# EAGLE schematic LR1302_LoRaWAN_Gateway_Module_V1.0_868SPI (EAGLE 9.5.1)
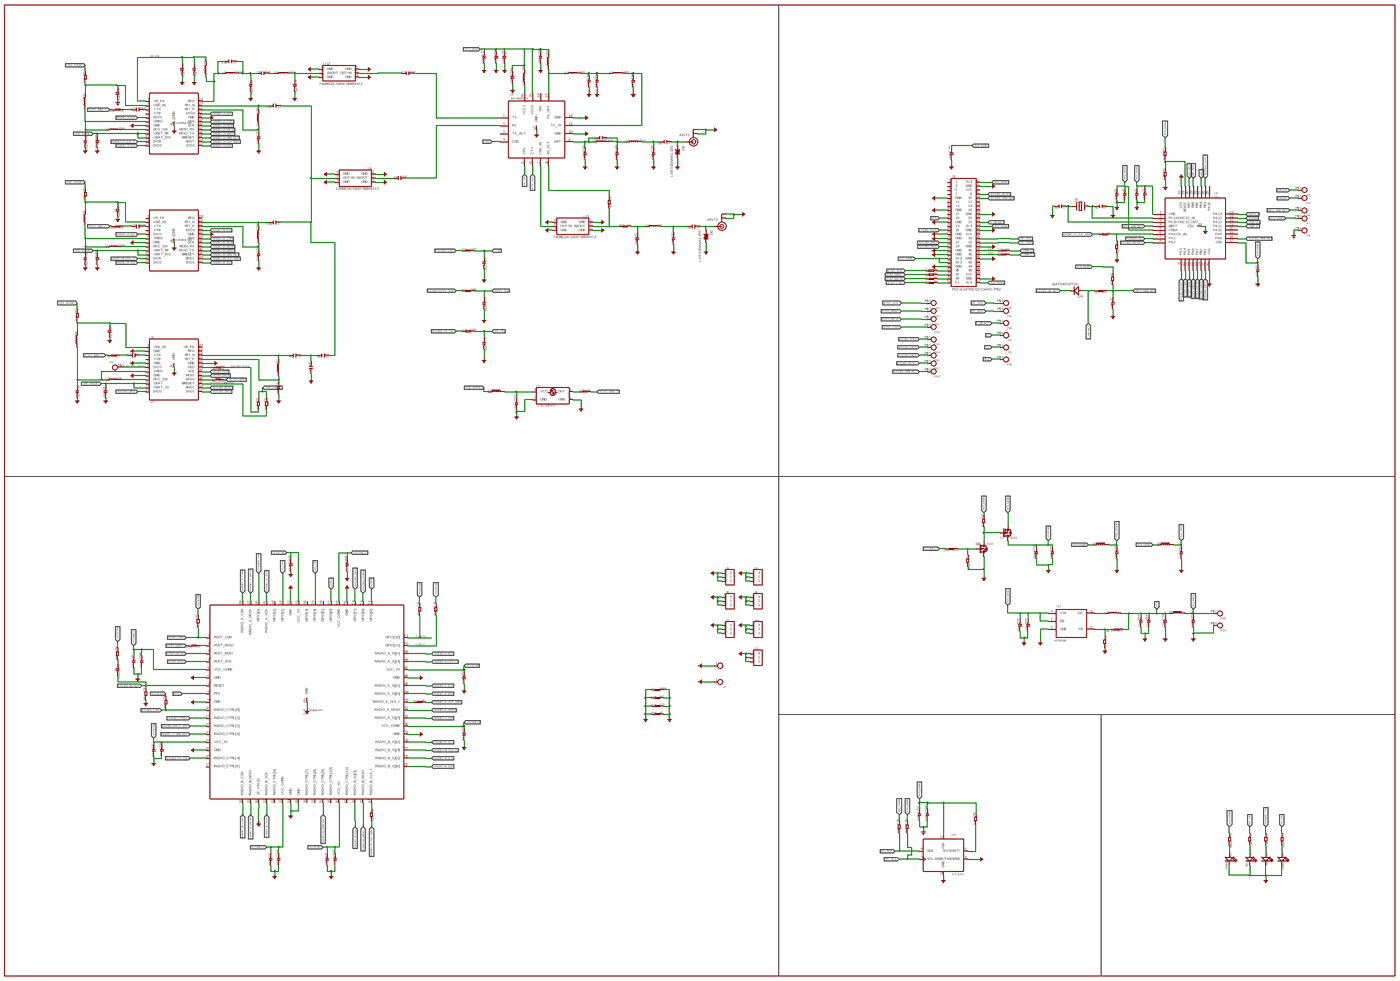
[diagram p0: schematic, sheet 1, overview]
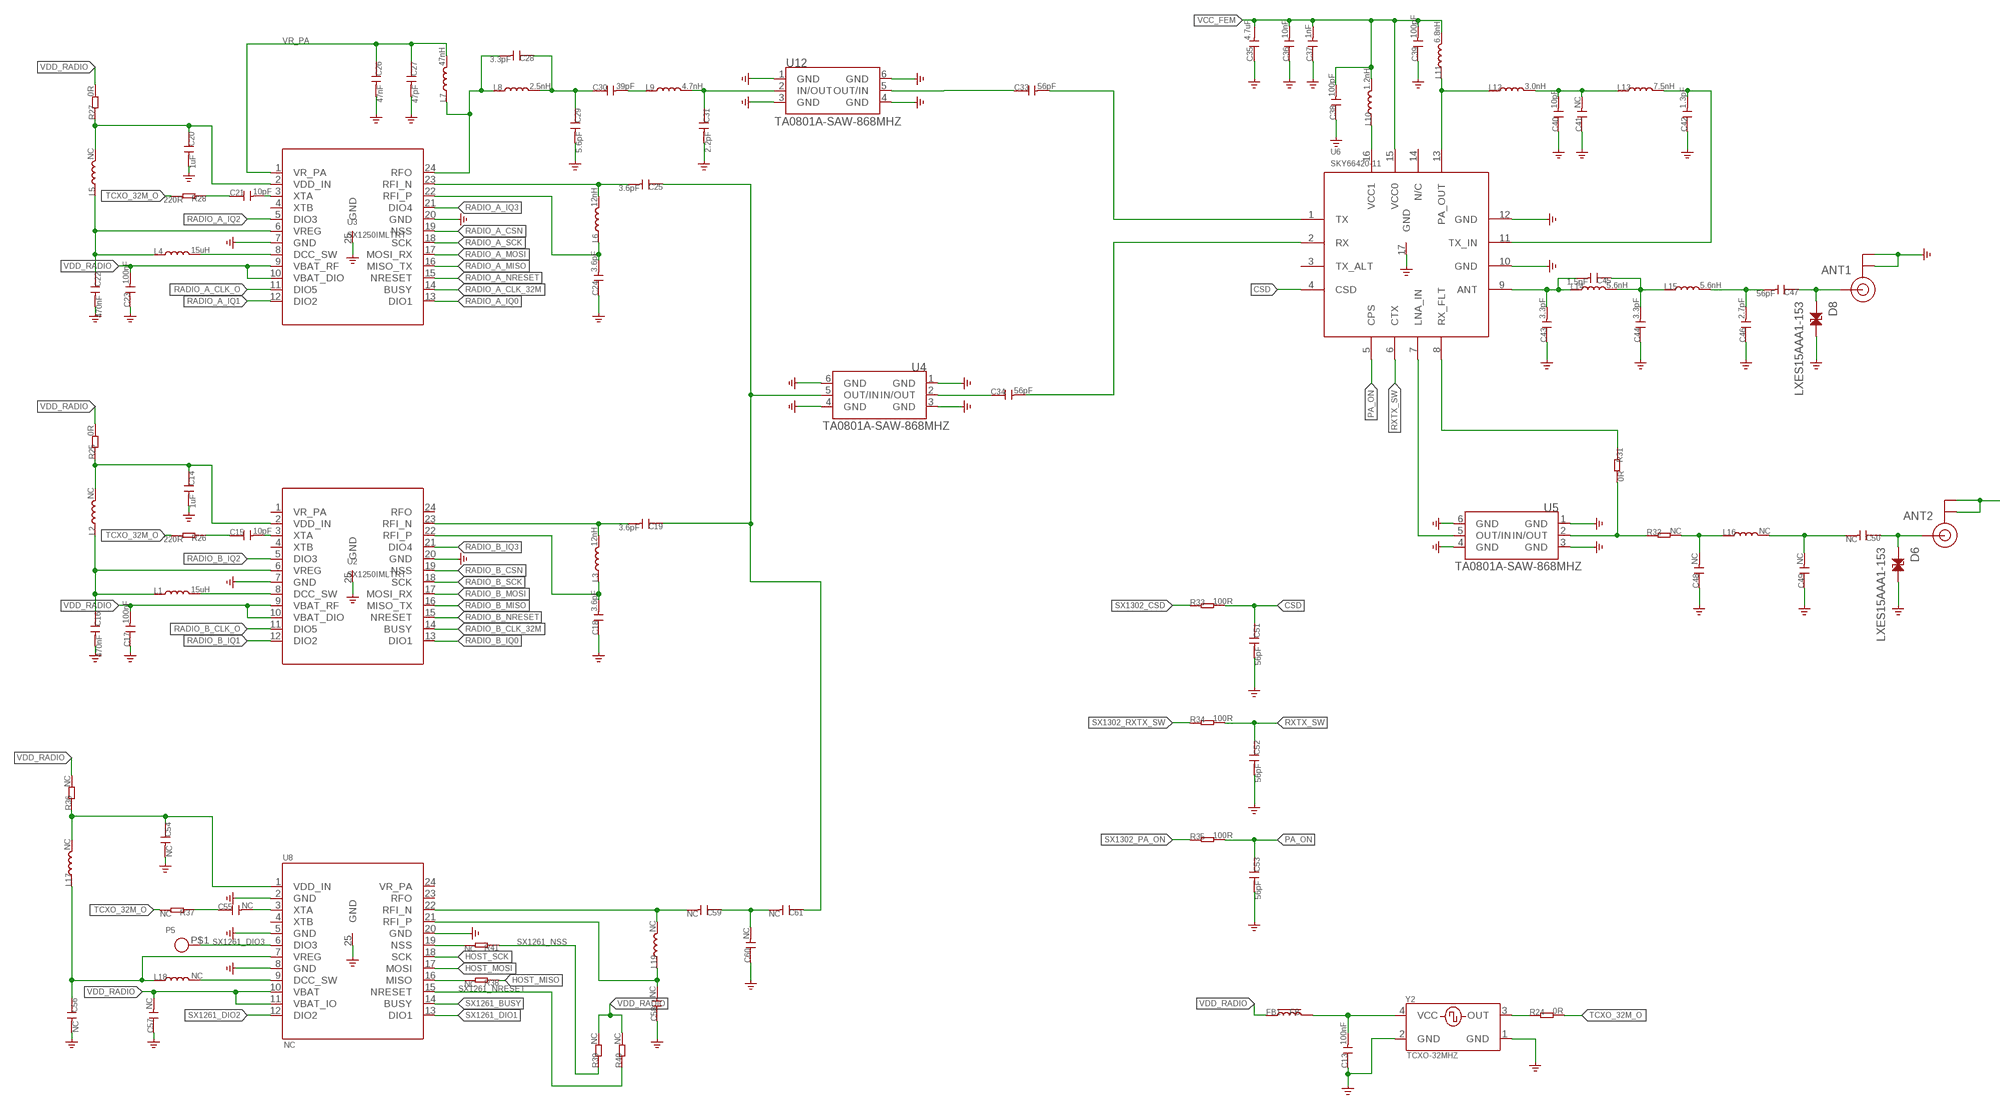
[diagram p1: schematic, sheet 1, part 1 of 4]
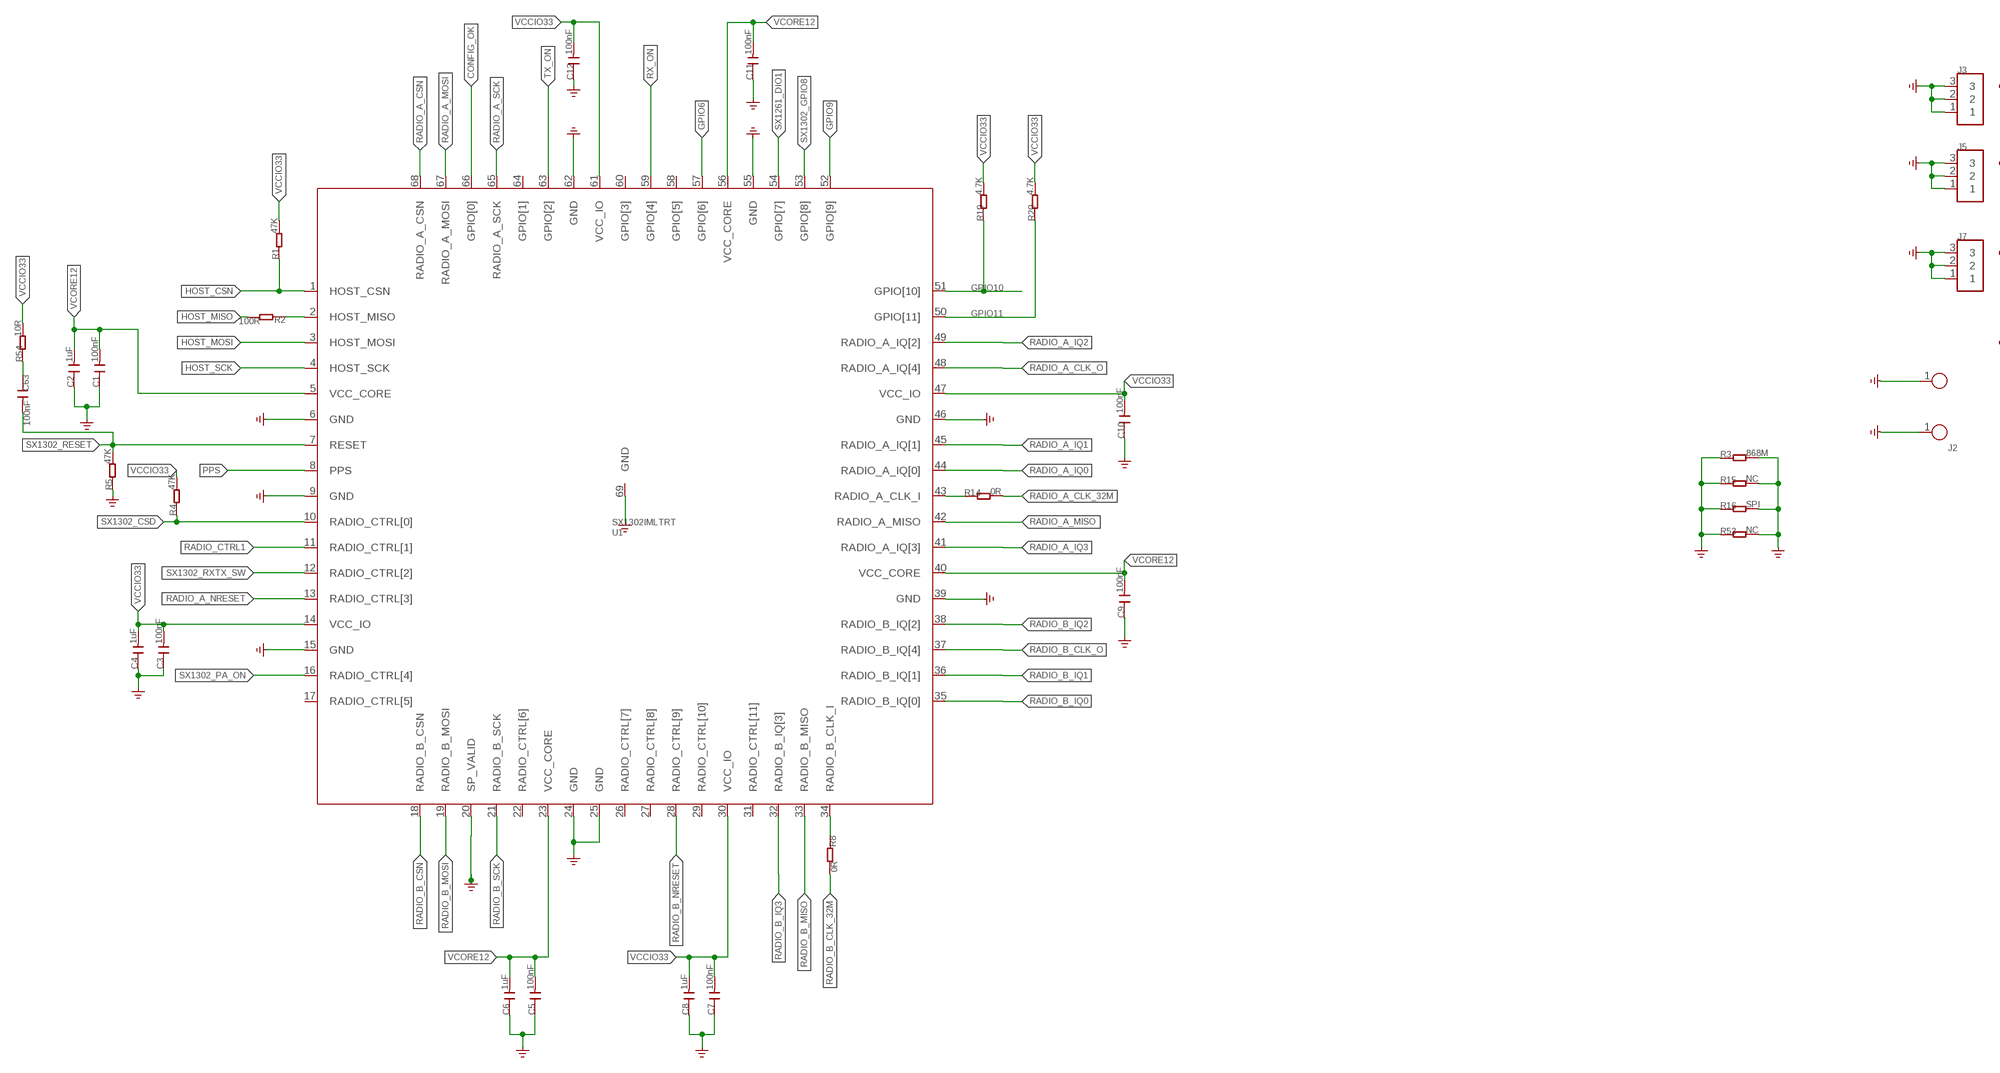
[diagram p2: schematic, sheet 1, part 2 of 4]
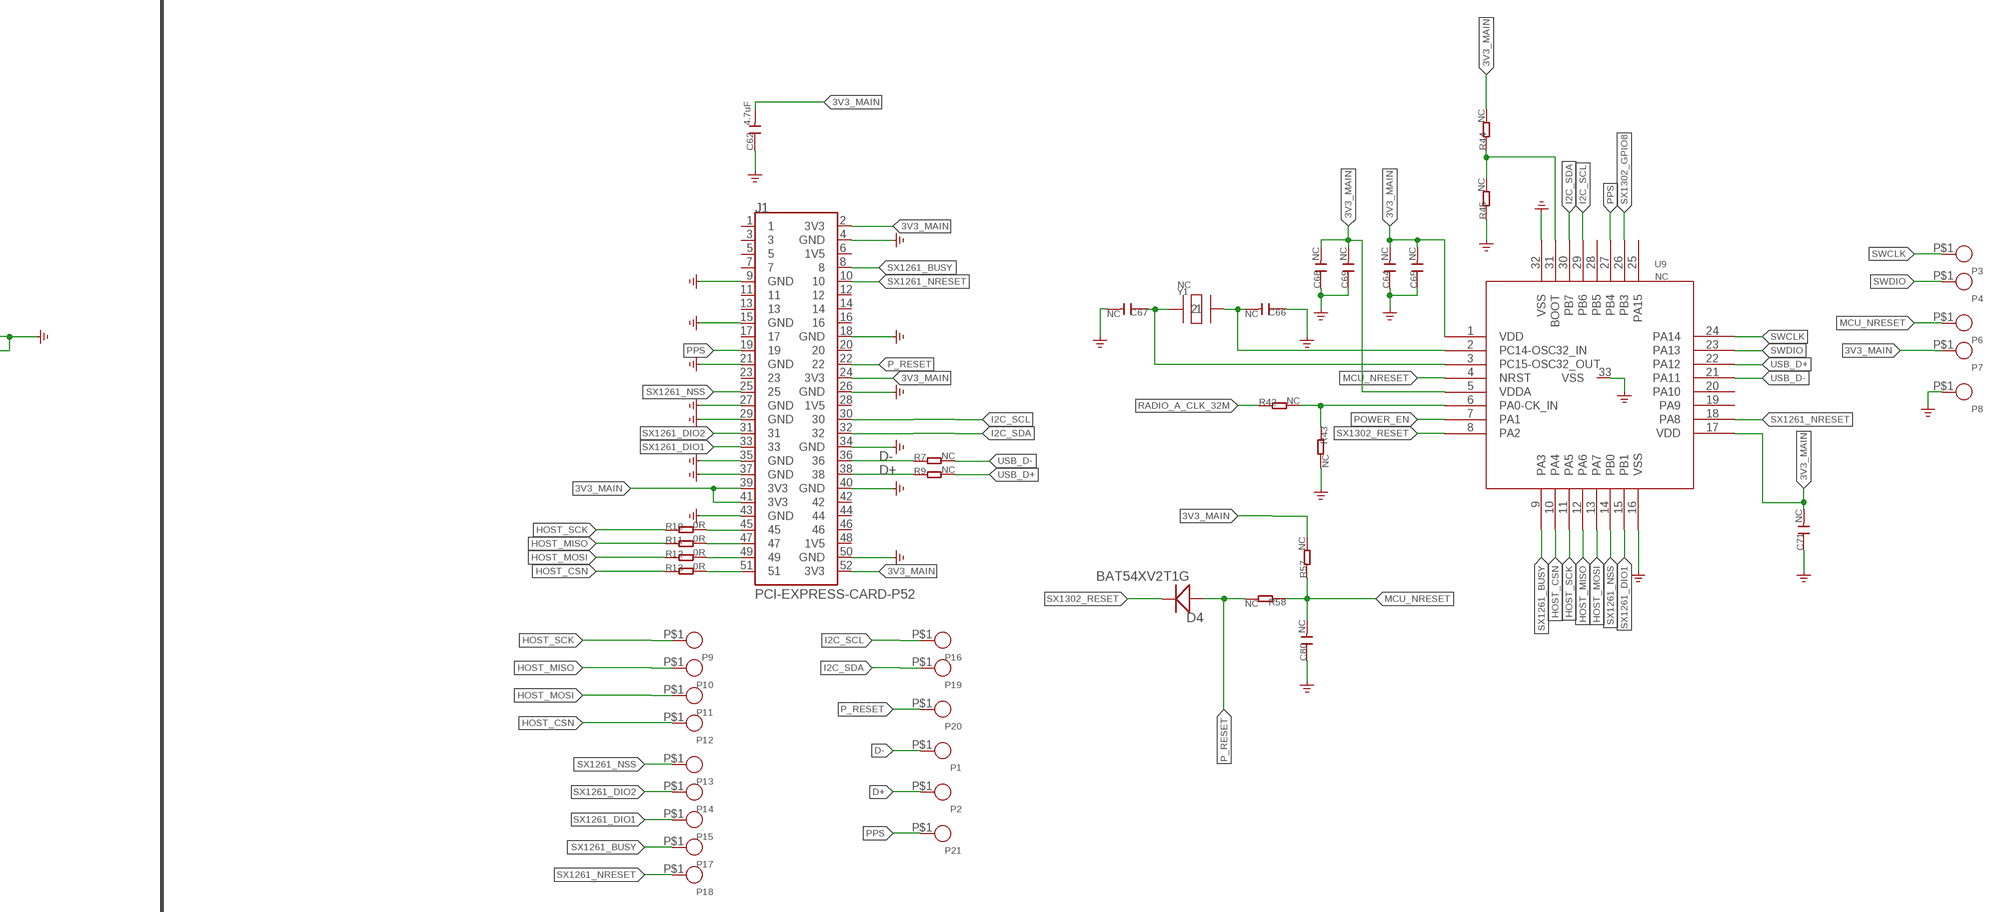
[diagram p3: schematic, sheet 1, part 3 of 4]
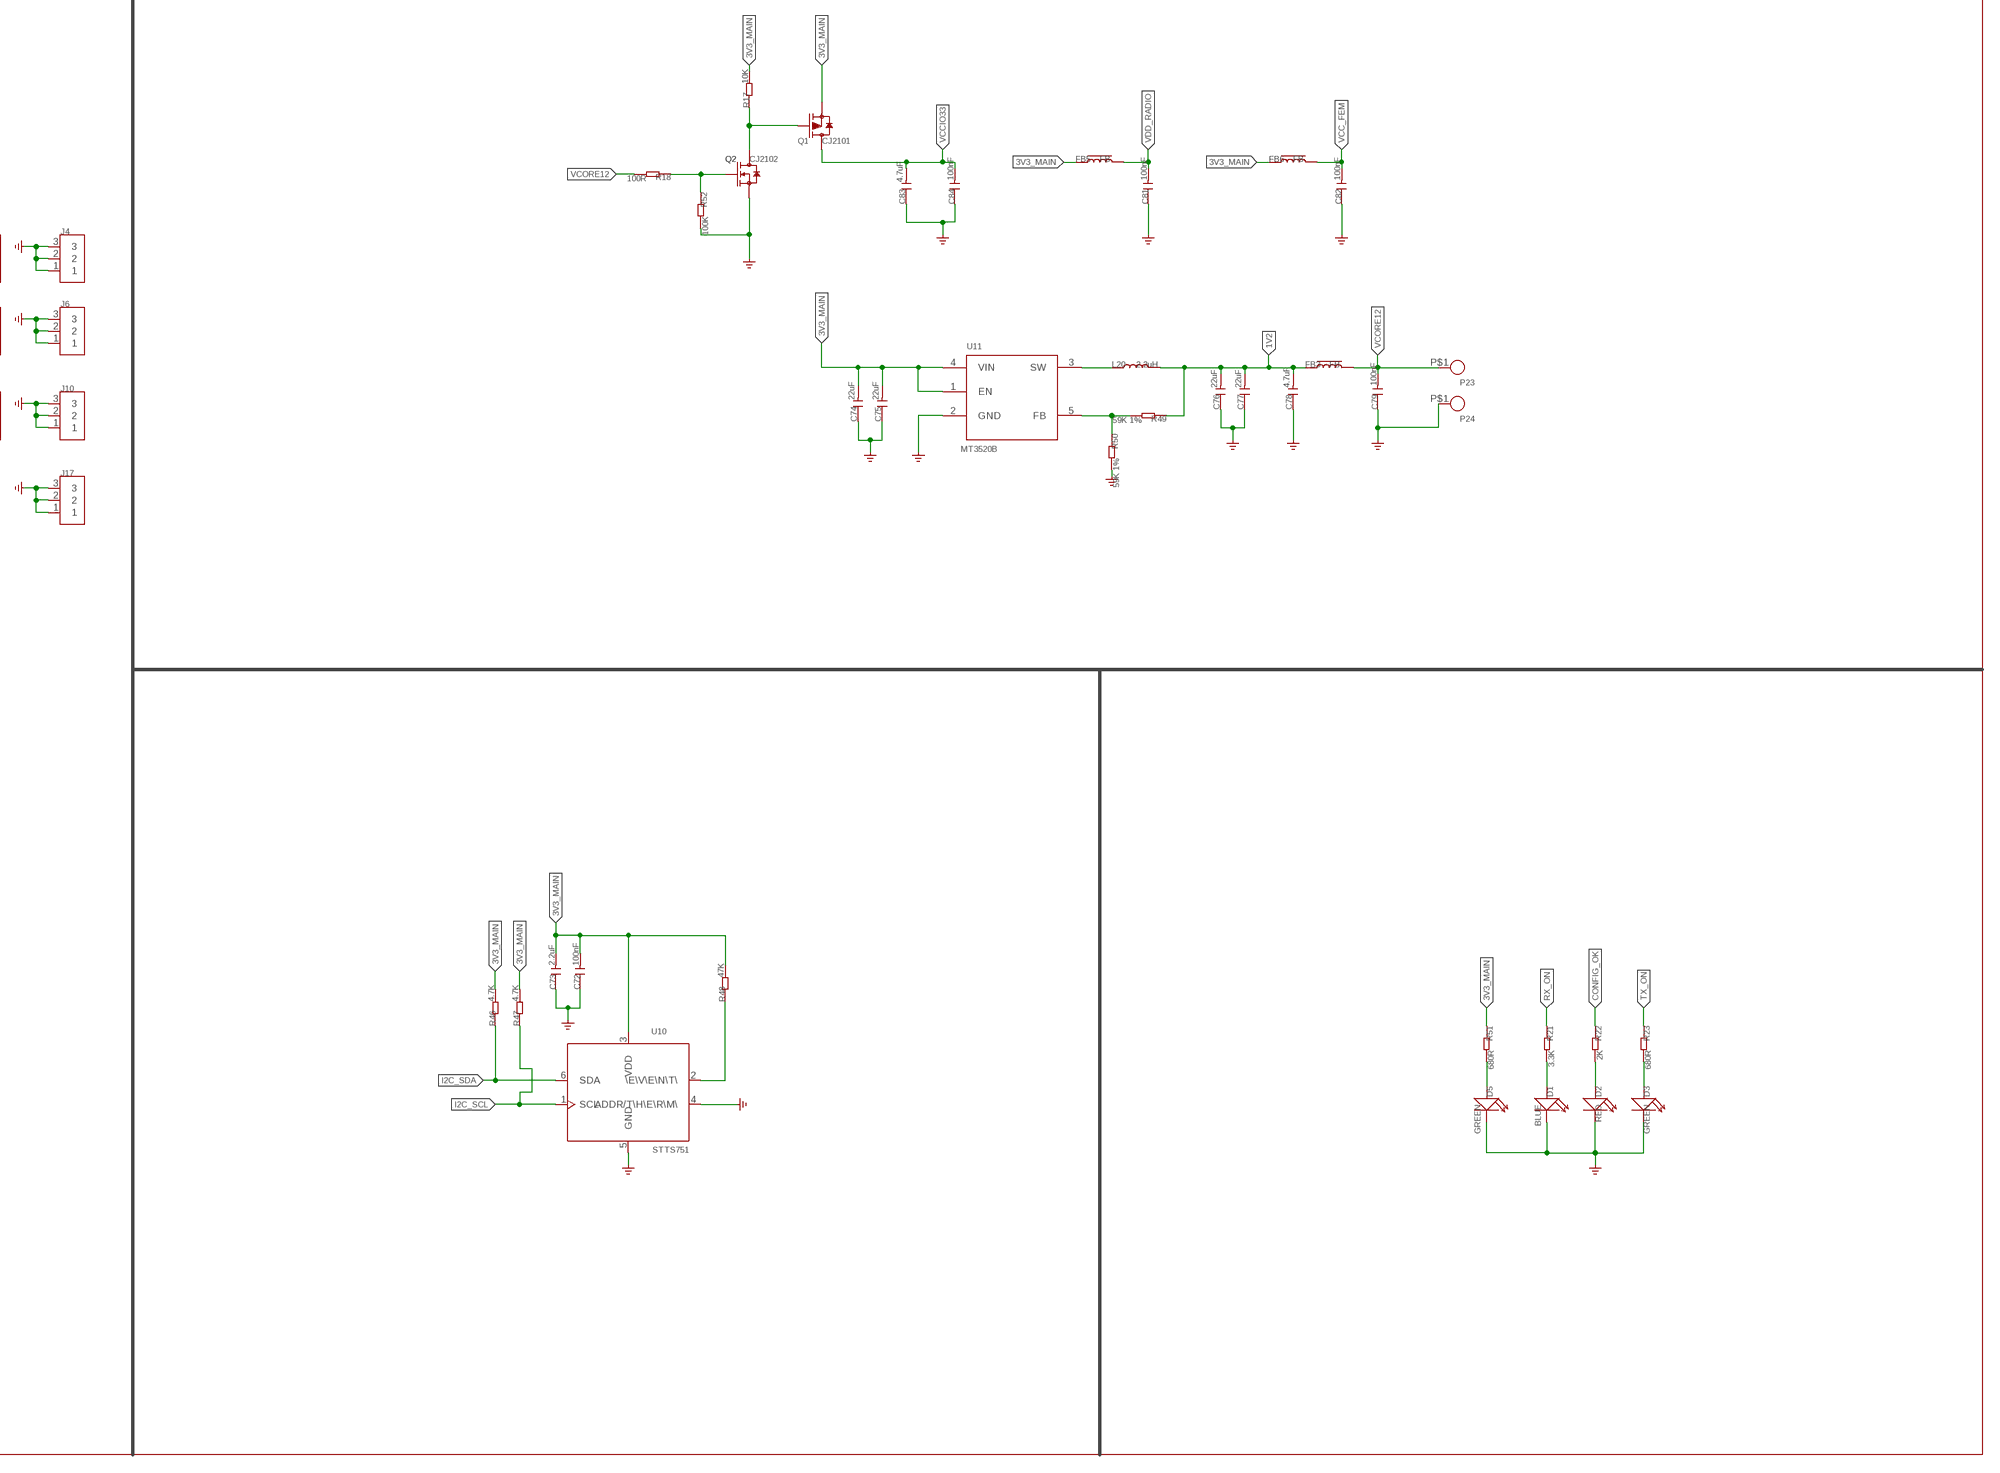
[diagram p4: schematic, sheet 1, part 4 of 4]

## Parts
ANT1  U.FL_SMTU.FL-R-SMD  [U.FL-R-SMD]
ANT2  NC  U.FL_SMTU.FL-R-SMD  [U.FL-R-SMD]
C1  100nF  CAPC0402-1  [C0402]
C2  1uF  CAPC0402-1  [C0402]
C3  100nF  CAPC0402-1  [C0402]
C4  1uF  CAPC0402-1  [C0402]
C5  100nF  CAPC0402-1  [C0402]
C6  1uF  CAPC0402-1  [C0402]
C7  100nF  CAPC0402-1  [C0402]
C8  1uF  CAPC0402-1  [C0402]
C9  100nF  CAPC0402-1  [C0402]
C10  100nF  CAPC0402-1  [C0402]
C11  100nF  CAPC0402-1  [C0402]
C12  100nF  CAPC0402-1  [C0402]
C13  100nF  CAPC0402-1  [C0402]
C14  1uF  CAPC0402-1  [C0402]
C15  10pF  CAPC0402-1  [C0402]
C16  470nF  CAPC0402-1  [C0402]
C17  100nF  CAPC0402-1  [C0402]
C18  3.6pF  CAPC0402-1  [C0402]
C19  3.6pF  CAPC0402-1  [C0402]
C20  1uF  CAPC0402-1  [C0402]
C21  10pF  CAPC0402-1  [C0402]
C22  470nF  CAPC0402-1  [C0402]
C23  100nF  CAPC0402-1  [C0402]
C24  3.6pF  CAPC0402-1  [C0402]
C25  3.6pF  CAPC0402-1  [C0402]
C26  47nF  CAPC0402-1  [C0402]
C27  47pF  CAPC0402-1  [C0402]
C28  3.3pF  CAPC0402-1  [C0402]
C29  5.6pF  CAPC0402-1  [C0402]
C30  39pF  CAPC0402-1  [C0402]
C31  2.2pF  CAPC0402-1  [C0402]
C33  56pF  CAPC0402-1  [C0402]
C34  56pF  CAPC0402-1  [C0402]
C35  4.7uF  CAP  [C0603]
C36  10nF  CAPC0402-1  [C0402]
C37  1nF  CAPC0402-1  [C0402]
C38  100pF  CAPC0402-1  [C0402]
C39  100pF  CAPC0402-1  [C0402]
C40  10pF  CAPC0402-1  [C0402]
C41  NC  CAPC0402-1  [C0402]
C42  1.3pF  CAPC0402-1  [C0402]
C43  3.3pF  CAPC0402-1  [C0402]
C44  3.3pF  CAPC0402-1  [C0402]
C45  1.5pF  CAPC0402-1  [C0402]
C46  2.7pF  CAPC0402-1  [C0402]
C47  56pF  CAPC0402-1  [C0402]
C48  NC  CAPC0402-1  [C0402]
C49  NC  CAPC0402-1  [C0402]
C50  NC  CAPC0402-1  [C0402]
C51  56pF  CAPC0402-1  [C0402]
C52  56pF  CAPC0402-1  [C0402]
C53  56pF  CAPC0402-1  [C0402]
C54  NC  CAPC0402-1  [C0402]
C55  NC  CAPC0402-1  [C0402]
C56  NC  CAPC0402-1  [C0402]
C57  NC  CAPC0402-1  [C0402]
C58  NC  CAPC0402-1  [C0402]
C59  NC  CAPC0402-1  [C0402]
C60  NC  CAPC0402-1  [C0402]
C61  NC  CAPC0402-1  [C0402]
C62  4.7uF  CAP  [C0603]
C63  100nF  CAPC0402-1  [C0402]
C64  NC  CAPC0402-1  [C0402]
C65  NC  CAPC0402-1  [C0402]
C66  NC  CAPC0402-1  [C0402]
C67  NC  CAPC0402-1  [C0402]
C68  NC  CAPC0402-1  [C0402]
C69  NC  CAPC0402-1  [C0402]
C71  NC  CAPC0402-1  [C0402]
C72  100nF  CAPC0402-1  [C0402]
C73  2.2uF  CAPC0402-1  [C0402]
C74  22uF  CAP  [C0603]
C75  22uF  CAP  [C0603]
C76  22uF  CAP  [C0603]
C77  22uF  CAP  [C0603]
C78  4.7uF  CAP  [C0603]
C79  100nF  CAPC0402-1  [C0402]
C80  NC  CAPC0402-1  [C0402]
C81  100nF  CAPC0402-1  [C0402]
C82  100nF  CAPC0402-1  [C0402]
C83  4.7uF  CAP  [C0603]
C84  100nF  CAPC0402-1  [C0402]
D1  BLUE  LED-SMT  [LED-0402]
D2  RED  LED-SMT  [LED-0402]
D3  GREEN  LED-SMT  [LED-0402]
D4  BAT54XV2T1G  DIODE0603  [D_SOD523]
D5  GREEN  LED-SMT  [LED-0402]
D6  LXES15AAA1-153  PESD0402  [D0402]
D8  LXES15AAA1-153  PESD0402  [D0402]
FB1  FB  [L0402]
FB3  FB  [L0402]
FB5  FB  [L0402]
FB6  FB  [L0402]
J1  PCI-EXPRESS-CARD-P52  [PCIE-MINI-S52]
J2  PAD-THO-2.65MM  [PAD-THO-2.6*5MM]
J3  PBJ-ICSRC6508-SMD  [PBJ-ICSRC6508-SMD]
J4  PBJ-ICSRC6508-SMD  [PBJ-ICSRC6508-SMD]
J5  PBJ-ICSRC6508-SMD  [PBJ-ICSRC6508-SMD]
J6  PBJ-ICSRC6508-SMD  [PBJ-ICSRC6508-SMD]
J7  PBJ-ICSRC6508-SMD  [PBJ-ICSRC6508-SMD]
J10  PBJ-ICSRC6508-SMD  [PBJ-ICSRC6508-SMD]
J11  PAD-THO-2.65MM  [PAD-THO-2.6*5MM]
J17  PBJ-ICSRC6508-SMD  [PBJ-ICSRC6508-SMD]
L1  15uH  L0805  [L0805]
L2  NC  L0402  [L0402]
L3  12nH  L0402  [L0402]
L4  15uH  L0805  [L0805]
L5  NC  L0402  [L0402]
L6  12nH  L0402  [L0402]
L7  47nH  L0402  [L0402]
L8  2.5nH  L0402  [L0402]
L9  4.7nH  L0402  [L0402]
L10  1.2nH  L0402  [L0402]
L11  6.8nH  L0402  [L0402]
L12  3.0nH  L0402  [L0402]
L13  7.5nH  L0402  [L0402]
L14  5.6nH  L0402  [L0402]
L15  5.6nH  L0402  [L0402]
L16  NC  L0402  [L0402]
L17  NC  L0402  [L0402]
L18  NC  L0805  [L0805]
L19  NC  L0402  [L0402]
L20  2.2uH  L  [L3015_SMD]
P1  TEST_PADPAD-1.0MM  [TEST_PAD-1.0MM]
P2  TEST_PADPAD-1.0MM  [TEST_PAD-1.0MM]
P3  TEST_PADPAD-1.0MM  [TEST_PAD-1.0MM]
P4  TEST_PADPAD-1.0MM  [TEST_PAD-1.0MM]
P5  TEST_PADPAD-1.0MM  [TEST_PAD-1.0MM]
P6  TEST_PADPAD-1.0MM  [TEST_PAD-1.0MM]
P7  TEST_PADPAD-1.0MM  [TEST_PAD-1.0MM]
P8  TEST_PADPAD-1.0MM  [TEST_PAD-1.0MM]
P9  TEST_PADPAD-1.0MM  [TEST_PAD-1.0MM]
P10  TEST_PADPAD-1.0MM  [TEST_PAD-1.0MM]
P11  TEST_PADPAD-1.0MM  [TEST_PAD-1.0MM]
P12  TEST_PADPAD-1.0MM  [TEST_PAD-1.0MM]
P13  TEST_PADPAD-1.0MM  [TEST_PAD-1.0MM]
P14  TEST_PADPAD-1.0MM  [TEST_PAD-1.0MM]
P15  TEST_PADPAD-1.0MM  [TEST_PAD-1.0MM]
P16  TEST_PADPAD-1.0MM  [TEST_PAD-1.0MM]
P17  TEST_PADPAD-1.0MM  [TEST_PAD-1.0MM]
P18  TEST_PADPAD-1.0MM  [TEST_PAD-1.0MM]
P19  TEST_PADPAD-1.0MM  [TEST_PAD-1.0MM]
P20  TEST_PADPAD-1.0MM  [TEST_PAD-1.0MM]
P21  TEST_PADPAD-1.0MM  [TEST_PAD-1.0MM]
P23  TEST_PADPAD-1.0MM  [TEST_PAD-1.0MM]
P24  TEST_PADPAD-1.0MM  [TEST_PAD-1.0MM]
Q1  CJ2101  MOSFET-P  [MOS_SOT323]
Q2  CJ2102  MOSFET-NSI1304BDL  [MOS_SOT323]
R1  47K  RES-0402  [R0402]
R2  100R  RES-0402  [R0402]
R3  868M  RES-0402  [R0402]
R4  47K  RES-0402  [R0402]
R5  47K  RES-0402  [R0402]
R7  NC  RES-0402  [R0402]
R8  0R  RES-0402  [R0402]
R9  NC  RES-0402  [R0402]
R10  0R  RES-0402  [R0402]
R11  0R  RES-0402  [R0402]
R12  0R  RES-0402  [R0402]
R13  0R  RES-0402  [R0402]
R14  0R  RES-0402  [R0402]
R15  NC  RES-0402  [R0402]
R16  SPI  RES-0402  [R0402]
R17  10K  RES-0402  [R0402]
R18  100R  RES-0402  [R0402]
R19  4.7K  RES-0402  [R0402]
R20  4.7K  RES-0402  [R0402]
R21  3.3K  RES-0402  [R0402]
R22  2K  RES-0402  [R0402]
R23  680R  RES-0402  [R0402]
R24  0R  RES-0402  [R0402]
R25  0R  RES-0402  [R0402]
R26  220R  RES-0402  [R0402]
R27  0R  RES-0402  [R0402]
R28  220R  RES-0402  [R0402]
R31  0R  RES-0402  [R0402]
R32  NC  RES-0402  [R0402]
R33  100R  RES-0402  [R0402]
R34  100R  RES-0402  [R0402]
R35  100R  RES-0402  [R0402]
R36  NC  RES-0402  [R0402]
R37  NC  RES-0402  [R0402]
R38  NC  RES-0402  [R0402]
R39  NC  RES-0402  [R0402]
R40  NC  RES-0402  [R0402]
R41  NC  RES-0402  [R0402]
R42  NC  RES-0402  [R0402]
R43  NC  RES-0402  [R0402]
R44  NC  RES-0402  [R0402]
R45  NC  RES-0402  [R0402]
R46  4.7K  RES-0402  [R0402]
R47  4.7K  RES-0402  [R0402]
R48  47K  RES-0402  [R0402]
R49  59K 1%  RES-0402  [R0402]
R50  59K 1%  RES-0402  [R0402]
R51  680R  RES-0402  [R0402]
R52  100K  RES-0402  [R0402]
R53  NC  RES-0402  [R0402]
R54  10R  RES-0402  [R0402]
R57  NC  RES-0402  [R0402]
R58  NC  RES-0402  [R0402]
U1  SX1302IMLTRT  [QFN68-7*7MM]
U2  SX1250IMLTRT  [QFN24-4*4MM]
U3  SX1250IMLTRT  [QFN24-4*4MM]
U4  TA0801A-SAW-868MHZ  [SAW-SMD6-3*3MM]
U5  TA0801A-SAW-868MHZ  [SAW-SMD6-3*3MM]
U6  SKY66420-11  [MCM-16-EP(3X3)]
U8  NC  SX1261IMLTRT  [QFN24-4*4MM]
U9  NC  STM32L412KX  [UFQFPN-32-5*5MM]
U10  STTS751  [UDFN-6(2X2)]
U11  MT3520B  [IC_SOT23-5]
U12  TA0801A-SAW-868MHZ  [SAW-SMD6-3*3MM]
Y1  NC  XTAL-32.768KHZ  [XATL-3215-SMD]
Y2  TCXO-32MHZ  [TXCO-SMD2.0*1.6]

## Nets
1V2: C76.2 C77.2 C78.2 FB3.1 L20.2 R49.1
3V3_MAIN: C62.2 C64.2 C65.2 C68.2 C69.2 C71.2 C72.2 C73.2 C74.2 C75.2 FB5.1 FB6.1 J1.2(3V3) J1.24(3V3) J1.39(3V3) J1.41(3V3) J1.52(3V3) P7.P$1 Q1.2(S) R17.2 R44.2 R46.2 R47.2 R48.2 R51.1 R57.2 U9.1(VDD) U9.5(VDDA) U9.17(VDD) U10.3(VDD) U11.1(EN) U11.4(VIN)
CONFIG_OK: R22.1 U1.66(GPIO[0])
CSD: C51.1 R33.2 U6.4(CSD)
D+: J1.38 P2.P$1 R9.1
D-: J1.36 P1.P$1 R7.1
GND: ANT1.2(GND) ANT1.3(GND) ANT2.2(GND) ANT2.3(GND) C1.1 C2.1 C3.1 C4.1 C5.1 C6.1 C7.1 C8.1 C9.1 C10.1 C11.1 C12.1 C13.1 C14.2 C16.2 C17.1 C18.1 C20.2 C22.2 C23.1 C24.1 C26.2 C27.2 C29.2 C31.2 C35.1 C36.1 C37.1 C38.1 C39.1 C40.1 C41.1 C42.1 C43.1 C44.1 C46.1 C48.1 C49.1 C51.2 C52.2 C53.2 C54.2 C56.2 C57.1 C58.1 C60.1 C62.1 C64.1 C65.1 C66.1 C67.2 C68.1 C69.1 C71.1 C72.1 C73.1 C74.1 C75.1 C76.1 C77.1 C78.1 C79.1 C80.1 C81.1 C82.1 C83.1 C84.1 D1.2(-) D2.2(-) D3.2(-) D5.2(-) D6.2 D8.2 J1.4(GND) J1.9(GND) J1.15(GND) J1.18(GND) J1.21(GND) J1.26(GND) J1.27(GND) J1.29(GND) J1.34(GND) J1.35(GND) J1.37(GND) J1.40(GND) J1.43(GND) J1.50(GND) J2.1 J3.1 J3.2 J3.3 J4.1 J4.2 J4.3 J5.1 J5.2 J5.3 J6.1 J6.2 J6.3 J7.1 J7.2 J7.3 J10.1 J10.2 J10.3 J11.1 J17.1 J17.2 J17.3 P8.P$1 P24.P$1 Q2.2(S) R3.1 R3.2 R5.1 R15.1 R15.2 R16.1 R16.2 R43.2 R45.1 R50.2 R52.2 R53.1 R53.2 U1.6(GND) U1.9(GND) U1.15(GND) U1.20(SP_VALID) U1.24(GND) U1.25(GND) U1.39(GND) U1.46(GND) U1.55(GND) U1.62(GND) U1.69(GND) U2.7(GND) U2.20(GND) U2.25(GND) U3.7(GND) U3.20(GND) U3.25(GND) U4.1(GND) U4.3(GND) U4.4(GND) U4.6(GND) U5.1(GND) U5.3(GND) U5.4(GND) U5.6(GND) U6.10(GND) U6.12(GND) U6.17(GND) U8.2(GND) U8.5(GND) U8.8(GND) U8.20(GND) U8.25(GND) U9.16(VSS) U9.32(VSS) U9.33(VSS) U10.4(ADDR/T\H\E\R\M\) U10.5(GND) U11.2(GND) U12.1(GND) U12.3(GND) U12.4(GND) U12.6(GND) Y2.1(GND) Y2.2(GND)
GPIO6: U1.57(GPIO[6])
GPIO9: U1.52(GPIO[9])
GPIO10: R19.1 U1.51(GPIO[10])
GPIO11: R20.1 U1.50(GPIO[11])
HOST_CSN: P12.P$1 R1.1 R13.1 U1.1(HOST_CSN) U9.10(PA4)
HOST_MISO: P10.P$1 R2.2 R11.1 R38.1 U9.12(PA6)
HOST_MOSI: P11.P$1 R12.1 U1.3(HOST_MOSI) U8.17(MOSI) U9.13(PA7)
HOST_SCK: P9.P$1 R10.1 U1.4(HOST_SCK) U8.18(SCK) U9.11(PA5)
I2C_SCL: J1.30 P16.P$1 R47.1 U9.29(PB6) U10.1(SCL)
I2C_SDA: J1.32 P19.P$1 R46.1 U9.30(PB7) U10.6(SDA)
MCU_NRESET: C80.2 P6.P$1 R57.1 R58.1 U9.4(NRST)
N$1: R2.1 U1.2(HOST_MISO)
N$3: J1.45 R10.2
N$4: R8.1 U1.34(RADIO_B_CLK_I)
N$6: J1.47 R11.2
N$7: J1.49 R12.2
N$8: J1.51 R13.2
N$10: C63.1 R54.1
N$11: R14.1 U1.43(RADIO_A_CLK_I)
N$12: Q1.1(G) Q2.3(D) R17.1
N$15: Q2.1(G) R18.1 R52.1
N$16: D3.1(+) R23.2
N$17: D2.1(+) R22.2
N$18: D1.1(+) R21.2
N$19: C13.2 FB1.2 Y2.4(VCC)
N$21: R24.1 Y2.3(OUT)
N$22: L1.2 U2.8(DCC_SW)
N$23: C14.1 L2.2 R25.1 U2.2(VDD_IN)
N$24: C16.1 L1.1 L2.1 U2.6(VREG)
N$25: C15.2 U2.3(XTA)
N$26: C15.1 R26.1
N$27: C18.2 L3.1 U2.22(RFI_P)
N$28 [ANT_50R]: C19.2 L3.2 U2.23(RFI_N)
N$29: C28.2 L7.1 L8.1 U3.24(RFO)
N$30: C20.1 L5.2 R27.1 U3.2(VDD_IN)
N$31: L4.2 U3.8(DCC_SW)
N$32: C22.1 L4.1 L5.1 U3.6(VREG)
N$33: C21.2 U3.3(XTA)
N$34: C21.1 R28.1
N$35: C24.2 L6.1 U3.22(RFI_P)
N$36 [ANT_50R]: C25.2 L6.2 U3.23(RFI_N)
N$37 [ANT_50R]: C30.2 L9.1
N$38 [ANT_50R]: C31.1 L9.2 U12.2(IN/OUT)
N$39 [ANT_50R]: C28.1 C29.1 C30.1 L8.2
N$40 [ANT_50R]: C33.1 U12.5(OUT/IN)
N$42 [ANT_50R]: C19.1 C25.1 C61.1 U4.5(OUT/IN)
N$43 [ANT_50R]: C34.1 U4.2(IN/OUT)
N$44 [ANT_50R]: C33.2 U6.1(TX)
N$45 [ANT_50R]: C34.2 U6.2(RX)
N$46: L10.1 U6.16(VCC1)
N$47 [ANT_50R]: U5.5(OUT/IN) U6.7(LNA_IN)
N$48 [ANT_50R]: L11.1 L12.1 U6.13(PA_OUT)
N$49 [ANT_50R]: C40.2 C41.2 L12.2 L13.1
N$50 [ANT_50R]: C42.2 L13.2 U6.11(TX_IN)
N$51 [ANT_50R]: C43.2 C45.2 L14.1 U6.9(ANT)
N$52 [ANT_50R]: C44.2 C45.1 L14.2 L15.1
N$53 [ANT_50R]: C46.2 C47.2 L15.2
N$54 [ANT_50R]: ANT1.1(SIGNAL) C47.1 D8.1
N$55 [ANT_50R]: R31.1 U6.8(RX_FLT)
N$56: C54.1 L17.2 R36.1 U8.1(VDD_IN)
N$57 [ANT_50R]: R31.2 R32.1 U5.2(IN/OUT)
N$58: C55.1 R37.1
N$59 [ANT_50R]: C49.2 C50.2 L16.2
N$60 [ANT_50R]: ANT2.1(SIGNAL) C50.1 D6.1
N$61 [ANT_50R]: C48.2 L16.1 R32.2
N$62: C55.2 U8.3(XTA)
N$63: L18.2 U8.9(DCC_SW)
N$64: C56.1 L17.1 L18.1 U8.7(VREG)
N$65: R38.2 U8.16(MISO)
N$66: C58.2 L19.1 U8.21(RFI_P)
N$67 [ANT_50R]: C59.2 L19.2 U8.22(RFI_N)
N$68 [ANT_50R]: C59.1 C60.2 C61.2
N$69: R41.2 U8.19(NSS)
N$70: R42.2 R43.1 U9.6(PA0-CK_IN)
N$71: C67.1 U9.3(PC15-OSC32_OUT) Y1.1
N$72: C66.2 U9.2(PC14-OSC32_IN) Y1.2
N$73: R48.1 U10.2(\E\V\E\N\T\)
N$74: D5.1(+) R51.2
N$75: L20.1 U11.3(SW)
N$77: R44.1 R45.2 U9.31(BOOT)
N$78: R49.2 R50.1 U11.5(FB)
P_RESET: D4.+ J1.22 P20.P$1 R58.2
PA_ON: C53.1 R35.2 U6.5(CPS)
POWER_EN: U9.7(PA1)
PPS: J1.19 P21.P$1 U1.8(PPS) U9.27(PB4)
RADIO_A_CLK_32M: R14.2 R42.1 U3.14(BUSY)
RADIO_A_CLK_O: U1.48(RADIO_A_IQ[4]) U3.11(DIO5)
RADIO_A_CSN: U1.68(RADIO_A_CSN) U3.19(NSS)
RADIO_A_IQ0: U1.44(RADIO_A_IQ[0]) U3.13(DIO1)
RADIO_A_IQ1: U1.45(RADIO_A_IQ[1]) U3.12(DIO2)
RADIO_A_IQ2: U1.49(RADIO_A_IQ[2]) U3.5(DIO3)
RADIO_A_IQ3: U1.41(RADIO_A_IQ[3]) U3.21(DIO4)
RADIO_A_MISO: U1.42(RADIO_A_MISO) U3.16(MISO_TX)
RADIO_A_MOSI: U1.67(RADIO_A_MOSI) U3.17(MOSI_RX)
RADIO_A_NRESET: U1.13(RADIO_CTRL[3]) U3.15(NRESET)
RADIO_A_SCK: U1.65(RADIO_A_SCK) U3.18(SCK)
RADIO_B_CLK_32M: R8.2 U2.14(BUSY)
RADIO_B_CLK_O: U1.37(RADIO_B_IQ[4]) U2.11(DIO5)
RADIO_B_CSN: U1.18(RADIO_B_CSN) U2.19(NSS)
RADIO_B_IQ0: U1.35(RADIO_B_IQ[0]) U2.13(DIO1)
RADIO_B_IQ1: U1.36(RADIO_B_IQ[1]) U2.12(DIO2)
RADIO_B_IQ2: U1.38(RADIO_B_IQ[2]) U2.5(DIO3)
RADIO_B_IQ3: U1.32(RADIO_B_IQ[3]) U2.21(DIO4)
RADIO_B_MISO: U1.33(RADIO_B_MISO) U2.16(MISO_TX)
RADIO_B_MOSI: U1.19(RADIO_B_MOSI) U2.17(MOSI_RX)
RADIO_B_NRESET: U1.28(RADIO_CTRL[9]) U2.15(NRESET)
RADIO_B_SCK: U1.21(RADIO_B_SCK) U2.18(SCK)
RADIO_CTRL1: U1.11(RADIO_CTRL[1])
RX_ON: R21.1 U1.59(GPIO[4])
RXTX_SW: C52.1 R34.2 U6.6(CTX)
SWCLK: P3.P$1 U9.24(PA14)
SWDIO: P4.P$1 U9.23(PA13)
SX1261_BUSY: J1.8 P17.P$1 U8.14(BUSY) U9.9(PA3)
SX1261_DIO1: J1.33 P15.P$1 U1.54(GPIO[7]) U8.13(DIO1) U9.15(PB1)
SX1261_DIO2: J1.31 P14.P$1 U8.12(DIO2)
SX1261_DIO3: P5.P$1 U8.6(DIO3)
SX1261_NRESET: J1.10 P18.P$1 R40.1 U8.15(NRESET) U9.18(PA8)
SX1261_NSS: J1.25 P13.P$1 R39.1 R41.1 U9.14(PB0)
SX1302_CSD: R4.1 R33.1 U1.10(RADIO_CTRL[0])
SX1302_GPIO8: U1.53(GPIO[8]) U9.26(PB3)
SX1302_PA_ON: R35.1 U1.16(RADIO_CTRL[4])
SX1302_RESET: C63.2 D4.- R5.2 U1.7(RESET) U9.8(PA2)
SX1302_RXTX_SW: R34.1 U1.12(RADIO_CTRL[2])
TCXO_32M_O: R24.2 R26.2 R28.2 R37.2
TX_ON: R23.1 U1.63(GPIO[2])
USB_D+: R9.2 U9.22(PA12)
USB_D-: R7.2 U9.21(PA11)
VCC_FEM: C35.2 C36.2 C37.2 C38.2 C39.2 C82.2 FB6.2 L10.2 L11.2 U6.15(VCC0)
VCCIO33: C3.2 C4.2 C7.2 C8.2 C10.2 C12.2 C83.2 C84.2 Q1.3(D) R1.2 R4.2 R19.2 R20.2 R54.2 U1.14(VCC_IO) U1.30(VCC_IO) U1.47(VCC_IO) U1.61(VCC_IO)
VCORE12: C1.2 C2.2 C5.2 C6.2 C9.2 C11.2 C79.2 FB3.2 P23.P$1 R18.2 U1.5(VCC_CORE) U1.23(VCC_CORE) U1.40(VCC_CORE) U1.56(VCC_CORE)
VDD_RADIO: C17.2 C23.2 C57.2 C81.2 FB1.1 FB5.2 R25.2 R27.2 R36.2 R39.2 R40.2 U2.9(VBAT_RF) U2.10(VBAT_DIO) U3.9(VBAT_RF) U3.10(VBAT_DIO) U8.10(VBAT) U8.11(VBAT_IO)
VR_PA: C26.1 C27.1 L7.2 U3.1(VR_PA)
Unconnected: J1.1 J1.3 J1.5 J1.6(1V5) J1.7 J1.11 J1.12 J1.13 J1.14 J1.16 J1.17 J1.20 J1.23 J1.28(1V5) J1.42 J1.44 J1.46 J1.48(1V5) U1.17(RADIO_CTRL[5]) U1.22(RADIO_CTRL[6]) U1.26(RADIO_CTRL[7]) U1.27(RADIO_CTRL[8]) U1.29(RADIO_CTRL[10]) U1.31(RADIO_CTRL[11]) U1.58(GPIO[5]) U1.60(GPIO[3]) U1.64(GPIO[1]) U2.1(VR_PA) U2.4(XTB) U2.24(RFO) U3.4(XTB) U6.3(TX_ALT) U6.14(N/C) U8.4(XTB) U8.23(RFO) U8.24(VR_PA) U9.19(PA9) U9.20(PA10) U9.25(PA15) U9.28(PB5)

## Notes on the sheet
- TA0801A-SAW-868MHZ

## Library data of the parts
ANT1 ANT2 = SX1302_Module:U.FL_SMT
C1-C31 C33-C69 C71-C84 = SX1302_Module:CAP*
D1-D3 D5 = SX1302_Module:LED-SMT*
D4 = SX1302_Module:DIODE*
D6 D8 = SX1302_Module:PESD0402: ESD protection diode PESD is used to protect a signal line from ESD.
FB1 FB3 FB5 FB6 = SX1302_Module:FB*
J1 = SX1302_Module:PCI-EXPRESS-CARD-P52
J2 J11 = SX1302_Module:PAD-THO-2.6*5MM
J3-J7 J10 J17 = SX1302_Module:PBJ-ICSRC6508-SMD
L1-L20 = SX1302_Module:L*
P1-P21 P23 P24 = SX1302_Module:TEST_PAD*
Q1 = SX1302_Module:MOSFET-P: IRLL014: http://www.vishay.com/docs/91319/sihll014.pdf
Q2 = SX1302_Module:MOSFET-N*: IRLL014: http://www.vishay.com/docs/91319/sihll014.pdf
R1-R5 R7-R28 R31-R54 R57 R58 = SX1302_Module:RES*
U1 = SX1302_Module:SX1302IMLTRT
U2 U3 = SX1302_Module:SX1250IMLTRT
U4 U5 U12 = SX1302_Module:TA0801A-SAW-868MHZ
U6 = SX1302_Module:SKY66420-11
U8 = SX1302_Module:SX1261IMLTRT
U9 = SX1302_Module:STM32L412KX
U10 = SX1302_Module:STTS751
U11 = SX1302_Module:MT3520B
Y1 = SX1302_Module:XTAL-32.768KHZ
Y2 = SX1302_Module:TCXO-32MHZ

## Net classes
1 ANT_50R: width 0.254 mm, clearance 0.381 mm